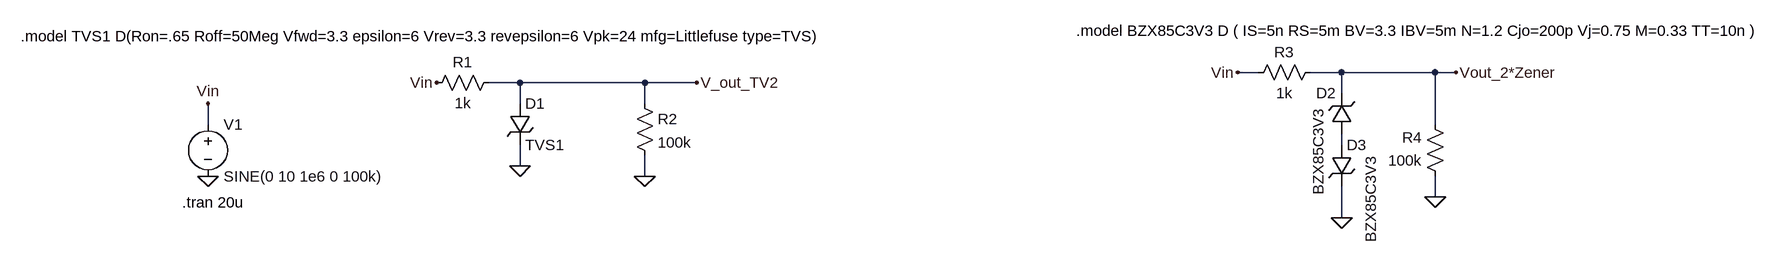
[diagram p0: schematic Protection_surtensions.asc]
Protection_surtensions.asc, the LTspice schematic file:
Version 4
SHEET 1 2436 680
WIRE 1536 80 1504 80
WIRE 1664 80 1616 80
WIRE 1808 80 1664 80
WIRE 1840 80 1808 80
WIRE 400 96 352 96
WIRE 592 96 400 96
WIRE 672 96 592 96
WIRE 1664 112 1664 80
WIRE 400 128 400 96
WIRE 592 128 592 96
WIRE -80 160 -80 128
WIRE 1808 160 1808 80
WIRE 1664 192 1664 176
WIRE 400 224 400 192
WIRE 592 240 592 208
WIRE 1808 272 1808 240
WIRE 1664 304 1664 256
FLAG -80 240 0
FLAG 400 224 0
FLAG 592 240 0
FLAG 1664 304 0
FLAG -80 128 Vin
FLAG 272 96 Vin
FLAG 672 96 V_out_TV2
FLAG 1504 80 Vin
FLAG 1840 80 Vout_2*Zener
FLAG 1808 272 0
SYMBOL TVSdiode 384 128 R0
SYMATTR InstName D1
SYMATTR Value TVS1
SYMBOL voltage -80 144 R0
WINDOW 123 0 0 Left 0
WINDOW 39 0 0 Left 0
SYMATTR InstName V1
SYMATTR Value SINE(0 10 1e6 0 100k)
SYMBOL res 368 80 R90
WINDOW 0 0 56 VBottom 2
WINDOW 3 32 56 VTop 2
SYMATTR InstName R1
SYMATTR Value 1k
SYMBOL res 576 112 R0
SYMATTR InstName R2
SYMATTR Value 100k
SYMBOL res 1632 64 R90
WINDOW 0 0 56 VBottom 2
WINDOW 3 32 56 VTop 2
SYMATTR InstName R3
SYMATTR Value 1k
SYMBOL res 1824 256 R180
WINDOW 0 36 76 Left 2
WINDOW 3 36 40 Left 2
SYMATTR InstName R4
SYMATTR Value 100k
SYMBOL zener 1680 176 R180
WINDOW 0 24 64 Left 2
WINDOW 3 52 -93 VRight 2
SYMATTR InstName D2
SYMATTR Value BZX85C3V3
SYMATTR Description Diode
SYMATTR Type diode
SYMBOL zener 1648 192 R0
WINDOW 3 61 17 VRight 2
SYMATTR Value BZX85C3V3
SYMATTR InstName D3
SYMATTR Description Diode
SYMATTR Type diode
TEXT -120 280 Left 2 !.tran 20u
TEXT -368 24 Left 2 !.model TVS1 D(Ron=.65 Roff=50Meg Vfwd=3.3 epsilon=6 Vrev=3.3 revepsilon=6 Vpk=24 mfg=Littlefuse type=TVS)
TEXT 1256 16 Left 2 !.model BZX85C3V3 D ( IS=5n RS=5m BV=3.3 IBV=5m N=1.2 Cjo=200p Vj=0.75 M=0.33 TT=10n )

The netlist it stands for:
* Protection_surtensions.asc
D1 V_out_TV2 0 TVS1
V1 Vin 0 SINE(0 10 1e6 0 100k)
R1 V_out_TV2 Vin 1k
R2 V_out_TV2 0 100k
R3 Vout_2*Zener Vin 1k
R4 0 Vout_2*Zener 100k
D2 N001 Vout_2*Zener BZX85C3V3
D3 N001 0 BZX85C3V3
.model D D
.lib standard.dio
.tran 20u
.model TVS1 D(Ron=.65 Roff=50Meg Vfwd=3.3 epsilon=6 Vrev=3.3 revepsilon=6 Vpk=24 mfg=Littlefuse type=TVS)
.model BZX85C3V3 D ( IS=5n RS=5m BV=3.3 IBV=5m N=1.2 Cjo=200p Vj=0.75 M=0.33 TT=10n )
.backanno
.end

* Results of the author's LTspice run, read from the files saved beside the schematic
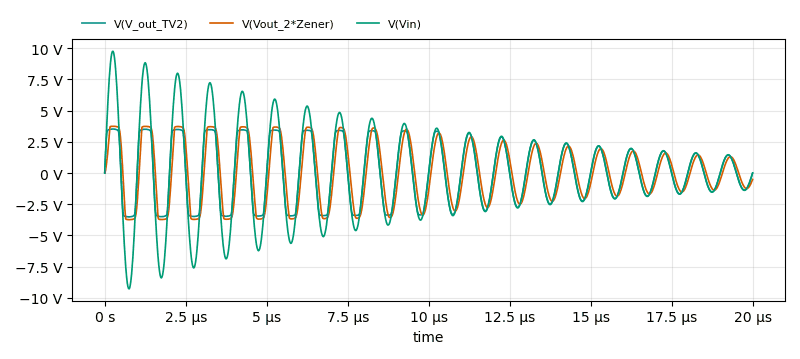
[diagram p1: Transient Analysis of Protection_surtensions.asc, plotted from the saved traces]
* Transient Analysis, 1 run:
*   V(V_out_TV2): min -3.511 V, max 3.519 V, average 27.45 mV, rms 2.379 V, last 0 V
*   V(Vout_2*Zener): min -3.734 V, max 3.739 V, average 30.11 mV, rms 2.342 V, last -514.3 mV
*   V(Vin): min -9.27 V, max 9.744 V, average 68.71 mV, rms 3.503 V, last 0 V